# EAGLE design darwin-radio (EAGLE 9.6.1)
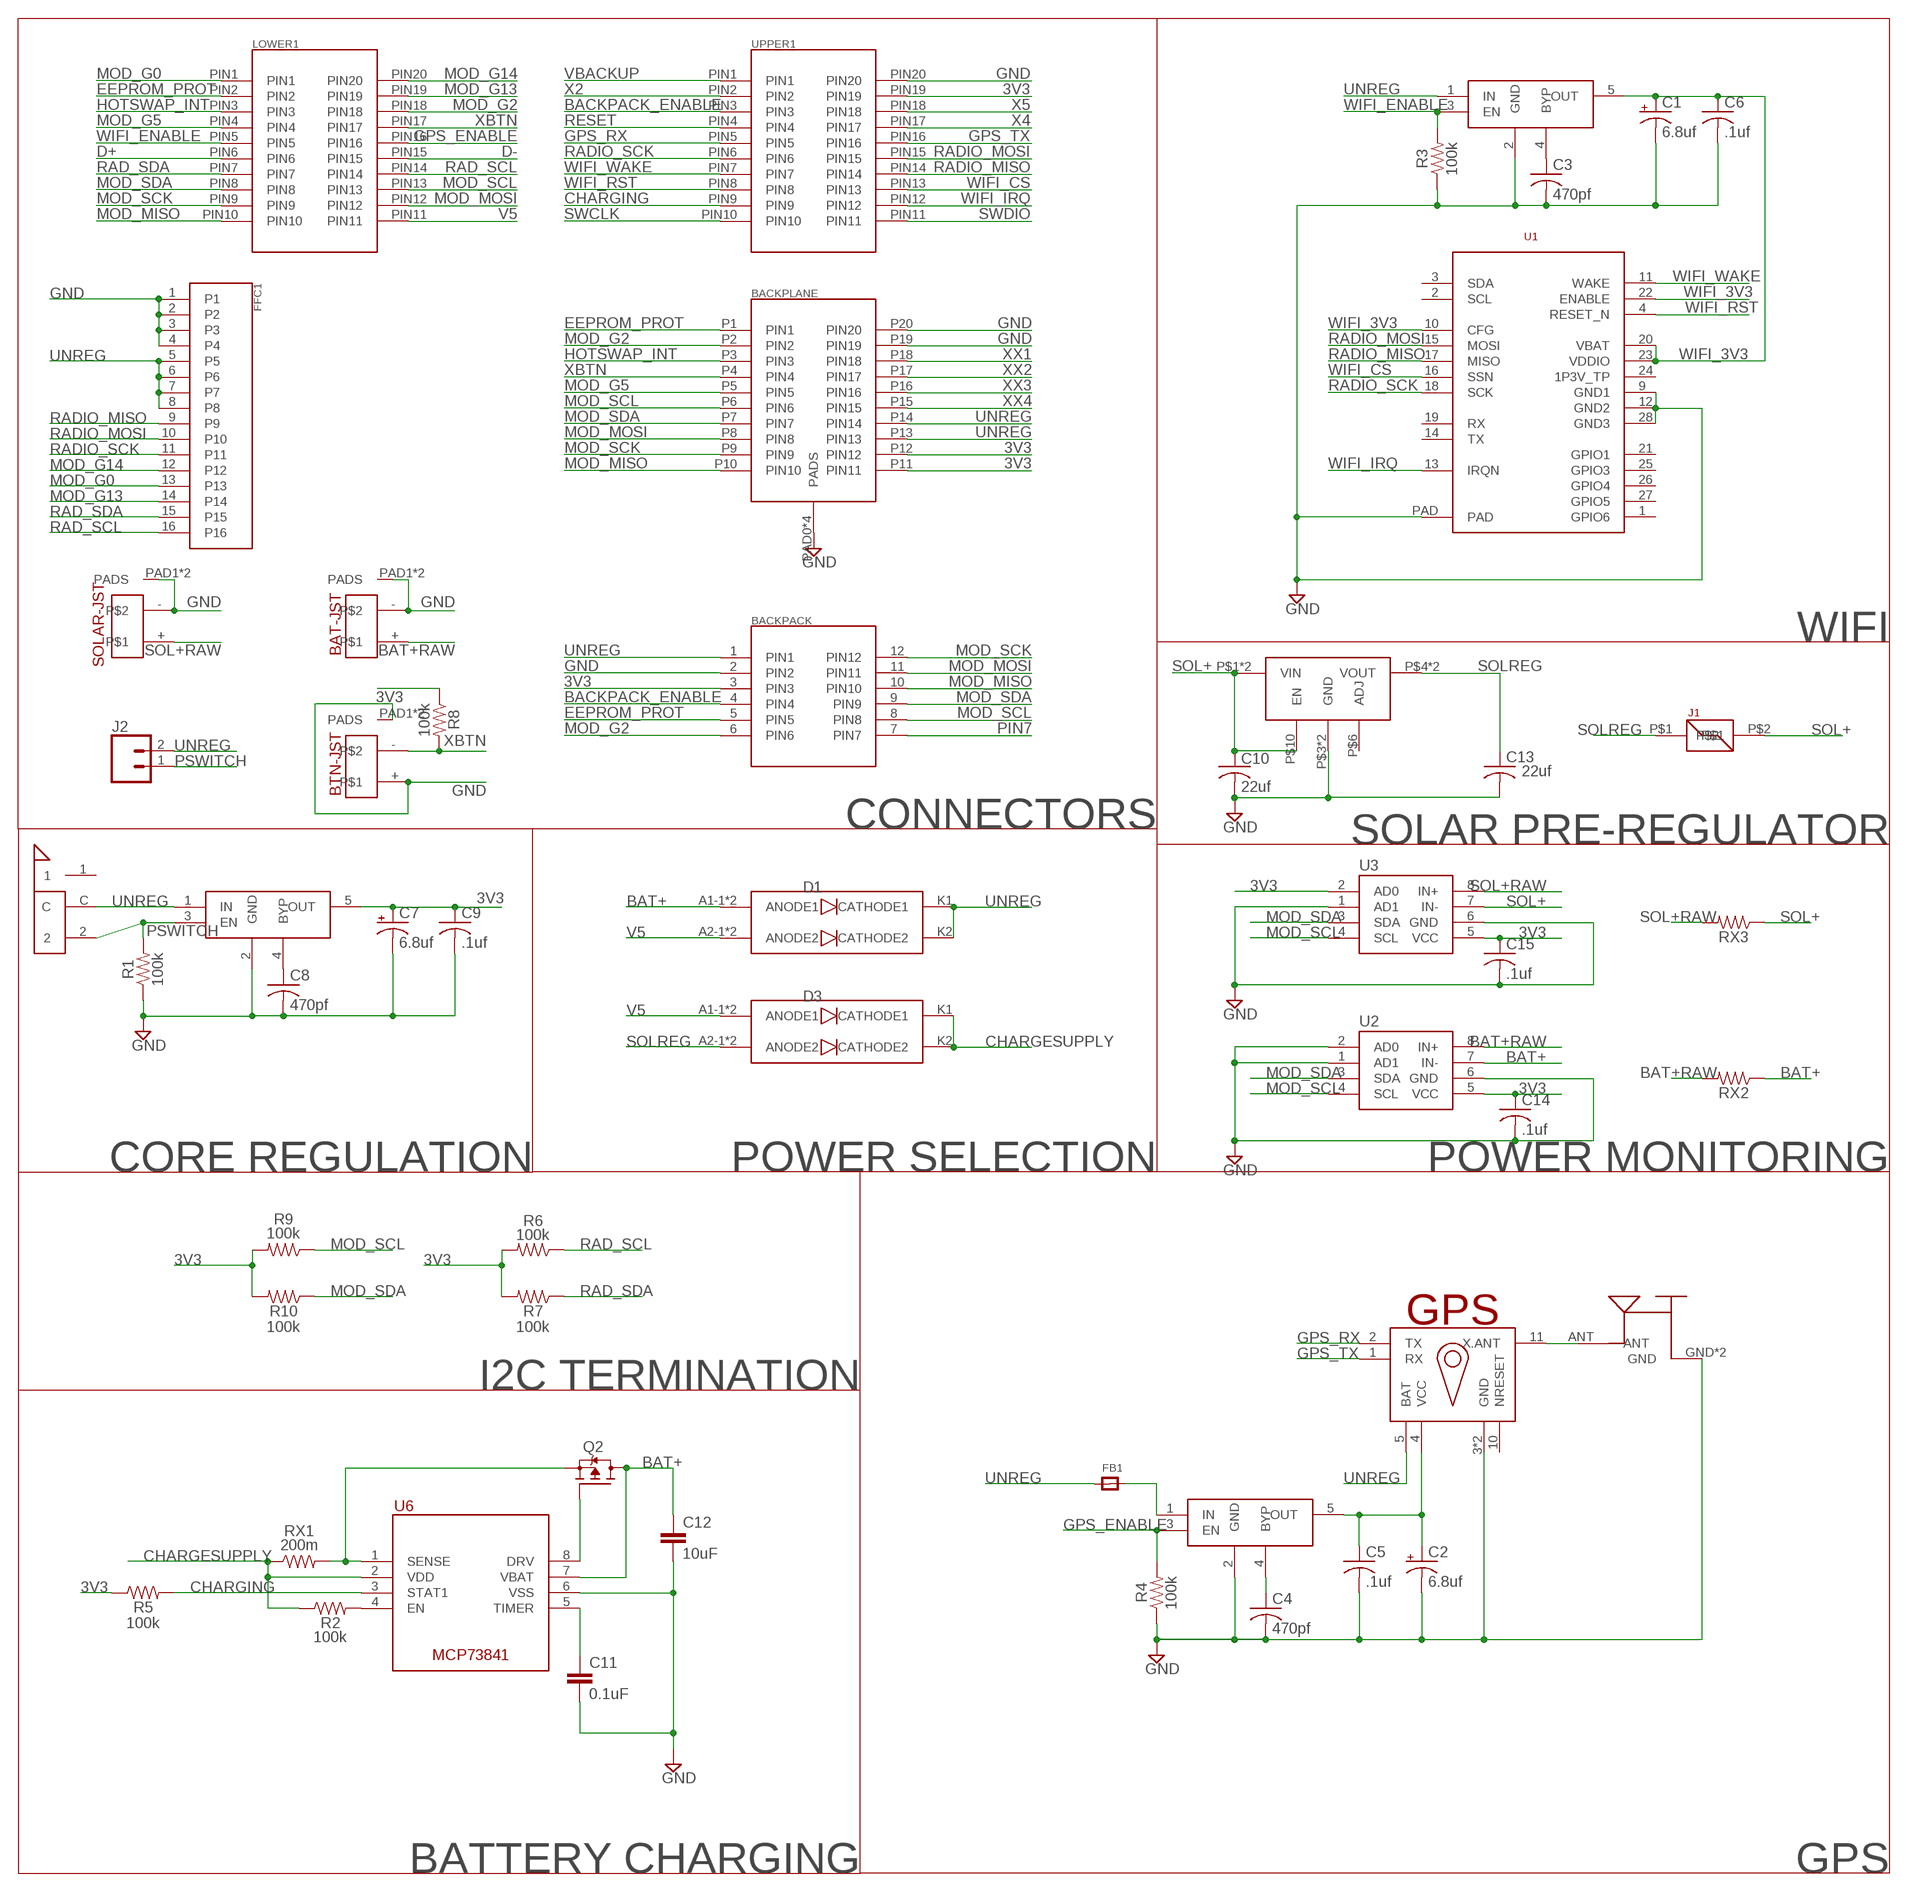
[diagram p0: schematic, sheet 1]

## Parts
BACKPACK  2X6-HEADERSDS  [12PH]
BACKPLANE  M55-6102042R  [M55-6102042R]
BAT-JST  B2B-PH-SM4-TB  [B2B-PH-SM4-TB]
BTN-JST  B2B-PH-SM4-TB  [B2B-PH-SM4-TB]
C1  6.8uf  CPOL-USA/3216-18R  [A/3216-18R]
C2  6.8uf  CPOL-USA/3216-18R  [A/3216-18R]
C3  470pf  C-USC0603K  [C0603K]
C4  470pf  C-USC0603K  [C0603K]
C5  .1uf  C-USC0603K  [C0603K]
C6  .1uf  C-USC0603K  [C0603K]
C7  6.8uf  CPOL-USA/3216-18R  [A/3216-18R]
C8  470pf  C-USC0603K  [C0603K]
C9  .1uf  C-USC0603K  [C0603K]
C10  22uf  C-USC0603K  [C0603K]
C11  0.1uF  0.1UF-0603-25V-(+80/-20%)  [0603]
C12  10uF  10UF-0603-6.3V-20%  [0603]
C13  22uf  C-USC0603K  [C0603K]
C14  .1uf  C-USC0603K  [C0603K]
C15  .1uf  C-USC0603K  [C0603K]
D1  V10KL45DUHM3/H  [V10KL45DUHM3/H]
D3  V10KL45DUHM3/H  [V10KL45DUHM3/H]
FB1  FERRITE0805  [0805]
FFC1  505110-1692  [505110-1692]
J1  S1911-46R  [S1911-46R]
J2  CONN_02LOCK_LONGPADS  [1X02_LOCK_LONGPADS]
LOWER1  MOLEX-15-91-2200  [20PH]
Q2  NDS8434  [SO08-IRF]
R1  100k  100KOHM-0603-1/10W-1%  [0603]
R2  100k  100KOHM-0603-1/10W-1%  [0603]
R3  100k  100KOHM-0603-1/10W-1%  [0603]
R4  100k  100KOHM-0603-1/10W-1%  [0603]
R5  100k  100KOHM-0603-1/10W-1%  [0603]
R6  100k  100KOHM-0603-1/10W-1%  [0603]
R7  100k  100KOHM-0603-1/10W-1%  [0603]
R8  100k  100KOHM-0603-1/10W-1%  [0603]
R9  100k  100KOHM-0603-1/10W-1%  [0603]
R10  100k  100KOHM-0603-1/10W-1%  [0603]
REG1  V78E06-1000-SMT-TR  [V78E06-1000-SMT-TR]
RX1  200m  R-US_R2512  [R2512]
RX2  100M  R-US_R2512  [R2512]
RX3  100M  R-US_R2512  [R2512]
SOLAR-JST  B2B-PH-SM4-TB  [B2B-PH-SM4-TB]
U1  ATWINC  [ATWINC]
U2  INA219  [SOIC127P599X175-8N]
U3  INA219  [SOIC127P599X175-8N]
U6  MCP7384X  [SOP65P490X110-8]
U$1  FGPMMOPA6HL80  [L80-M39]
U$2  MIC5219-3.3YM5-TR  [SOT95P280X145-5]
U$3  MIC5219-3.3YM5-TR  [SOT95P280X145-5]
U$4  MIC5219-3.3YM5-TR  [SOT95P280X145-5]
U$5  SSAJ110100  [SSAJ110100]
U$11  2337019-1  [2337019-1]
UPPER1  MOLEX-15-91-2200  [20PH]

## Nets
3V3: BACKPACK.3(PIN3) BACKPLANE.P11(PIN11) BACKPLANE.P12(PIN12) C7.+ C9.1 C14.1 C15.1 R5.1 R6.2 R7.2 R8.1 R9.2 R10.2 U2.5(VCC) U3.2(AD0) U3.5(VCC) U$4.5(OUT) UPPER1.PIN19
BACKPACK_ENABLE: BACKPACK.4(PIN4) UPPER1.PIN3
BAT+: C12.1 D1.A1-1(ANODE1) D1.A1-2(ANODE1) Q2.5(D) Q2.6(D) Q2.7(D) Q2.8(D) RX2.1 U2.7(IN-) U6.7(VBAT)
BAT+RAW: BAT-JST.+ RX2.2 U2.8(IN+)
CHARGESUPPLY: D3.K1(CATHODE1) D3.K2(CATHODE2) R2.1 RX1.1 U6.2(VDD)
CHARGING: R5.2 U6.3(STAT1) UPPER1.PIN9
D+: LOWER1.PIN6
D-: LOWER1.PIN15
EEPROM_PROT: BACKPACK.5(PIN5) BACKPLANE.P1(PIN1) LOWER1.PIN2
GND: BACKPACK.2(PIN2) BACKPLANE.P19(PIN19) BACKPLANE.P20(PIN20) BACKPLANE.PAD0(PADS) BACKPLANE.PAD1(PADS) BACKPLANE.PAD2(PADS) BACKPLANE.PAD3(PADS) BAT-JST.- BAT-JST.PAD1(PADS) BAT-JST.PAD2(PADS) BTN-JST.+ BTN-JST.PAD1(PADS) BTN-JST.PAD2(PADS) C1.- C2.- C3.2 C4.2 C5.2 C6.2 C7.- C8.2 C9.2 C10.2 C11.2 C12.2 C13.2 C14.2 C15.2 FFC1.1 FFC1.2 FFC1.3 FFC1.4 R1.1 R3.1 R4.1 REG1.P$3(GND) REG1.P$7(GND) SOLAR-JST.- SOLAR-JST.PAD1(PADS) SOLAR-JST.PAD2(PADS) U1.9(GND1) U1.12(GND2) U1.28(GND3) U1.PAD U2.1(AD1) U2.2(AD0) U2.6(GND) U3.1(AD1) U3.6(GND) U6.6(VSS) U$1.3(GND) U$1.12(GND) U$2.2(GND) U$3.2(GND) U$4.2(GND) U$11.GND U$11.GND2(GND) UPPER1.PIN20
GPS_ENABLE: LOWER1.PIN16 R4.2 U$2.3(EN)
GPS_RX: U$1.2(TX) UPPER1.PIN5
GPS_TX: U$1.1(RX) UPPER1.PIN16
HOTSWAP_INT: BACKPLANE.P3(PIN3) LOWER1.PIN3
MOD_G0: FFC1.13 LOWER1.PIN1
MOD_G2: BACKPACK.6(PIN6) BACKPLANE.P2(PIN2) LOWER1.PIN18
MOD_G5: BACKPLANE.P5(PIN5) LOWER1.PIN4
MOD_G13: FFC1.14 LOWER1.PIN19
MOD_G14: FFC1.12 LOWER1.PIN20
MOD_MISO: BACKPACK.10(PIN10) BACKPLANE.P10(PIN10) LOWER1.PIN10
MOD_MOSI: BACKPACK.11(PIN11) BACKPLANE.P8(PIN8) LOWER1.PIN12
MOD_SCK: BACKPACK.12(PIN12) BACKPLANE.P9(PIN9) LOWER1.PIN9
MOD_SCL: BACKPACK.8(PIN8) BACKPLANE.P6(PIN6) LOWER1.PIN13 R9.1 U2.4(SCL) U3.4(SCL)
MOD_SDA: BACKPACK.9(PIN9) BACKPLANE.P7(PIN7) LOWER1.PIN8 R10.1 U2.3(SDA) U3.3(SDA)
N$1: C3.1 U$3.4(BYP)
N$2: C4.1 U$2.4(BYP)
N$3: C2.+ C5.1 U$1.4(VCC) U$2.5(OUT)
N$4: U$1.11(X.ANT) U$11.ANT
N$5: R2.2 U6.4(EN)
N$6: C8.1 U$4.4(BYP)
N$7: FB1.2 U$2.1(IN)
N$14: Q2.1(S) Q2.2(S) Q2.3(S) RX1.2 U6.1(SENSE)
N$17: Q2.4(G) U6.8(DRV)
N$18: C11.1 U6.5(TIMER)
PIN7: BACKPACK.7(PIN7)
PSWITCH: J2.1 R1.2 U$4.3(EN) U$5.2
RAD_SCL: FFC1.16 LOWER1.PIN14 R6.1
RAD_SDA: FFC1.15 LOWER1.PIN7 R7.1
RADIO_MISO: FFC1.9 U1.17(MISO) UPPER1.PIN14
RADIO_MOSI: FFC1.10 U1.15(MOSI) UPPER1.PIN15
RADIO_SCK: FFC1.11 U1.18(SCK) UPPER1.PIN6
RESET: UPPER1.PIN4
SOL+: C10.1 J1.P$2 REG1.P$1(VIN) REG1.P$2(VIN) REG1.P$10(EN) RX3.1 U3.7(IN-)
SOL+RAW: RX3.2 SOLAR-JST.+ U3.8(IN+)
SOLREG: C13.1 D3.A2-1(ANODE2) D3.A2-2(ANODE2) J1.P$1 REG1.P$4(VOUT) REG1.P$5(VOUT)
SWCLK: UPPER1.PIN10
SWDIO: UPPER1.PIN11
UNREG: BACKPACK.1(PIN1) BACKPLANE.P13(PIN13) BACKPLANE.P14(PIN14) D1.K1(CATHODE1) D1.K2(CATHODE2) FB1.1 FFC1.5 FFC1.6 FFC1.7 FFC1.8 J2.2 U$1.5(BAT) U$3.1(IN) U$4.1(IN) U$5.C
V5: D1.A2-1(ANODE2) D1.A2-2(ANODE2) D3.A1-1(ANODE1) D3.A1-2(ANODE1) LOWER1.PIN11
VBACKUP: UPPER1.PIN1
WIFI_3V3: C1.+ C6.1 U1.10(CFG) U1.20(VBAT) U1.22(ENABLE) U1.23(VDDIO) U$3.5(OUT)
WIFI_CS: U1.16(SSN) UPPER1.PIN13
WIFI_ENABLE: LOWER1.PIN5 R3.2 U$3.3(EN)
WIFI_IRQ: U1.13(IRQN) UPPER1.PIN12
WIFI_RST: U1.4(RESET_N) UPPER1.PIN8
WIFI_WAKE: U1.11(WAKE) UPPER1.PIN7
X2: UPPER1.PIN2
X4: UPPER1.PIN17
X5: UPPER1.PIN18
XBTN: BACKPLANE.P4(PIN4) BTN-JST.- LOWER1.PIN17 R8.2
XX1: BACKPLANE.P18(PIN18)
XX2: BACKPLANE.P17(PIN17)
XX3: BACKPLANE.P16(PIN16)
XX4: BACKPLANE.P15(PIN15)
Unconnected: REG1.P$6(ADJ) U1.1(GPIO6) U1.2(SCL) U1.3(SDA) U1.14(TX) U1.19(RX) U1.21(GPIO1) U1.24(1P3V_TP) U1.25(GPIO3) U1.26(GPIO4) U1.27(GPIO5) U$1.10(NRESET) U$5.1

## Notes on the sheet
- WIFI
- CONNECTORS
- SOLAR PRE-REGULATOR
- CORE REGULATION | POWER SELECTION | POWER MONITORING
- I2C TERMINATION
- BATTERY CHARGING | GPS

## Library data of the parts
BACKPACK = Conservify:2X6-HEADERS
BACKPLANE = Conservify:M55-6102042R
BAT-JST BTN-JST SOLAR-JST = Conservify:B2B-PH-SM4-TB
C1 C2 C7 = rcl:CPOL-US: POLARIZED CAPACITOR, American symbol; SPICEPREFIX: C
C3-C6 C8-C10 C13-C15 = rcl:C-US: CAPACITOR, American symbol; SPICEPREFIX: C
C11 = SparkFun-Capacitors:0.1UF: 0.1µF ceramic capacitors A capacitor is a passive two-terminal electrical component used to store electrical energy temporarily in an electric field.; PROD_ID: CAP-00810
C12 = SparkFun-Capacitors:10UF: 10.0µF ceramic capacitors A capacitor is a passive two-terminal electrical component used to store electrical energy temporarily in an electric field.; PROD_ID: CAP-11015
D1 D3 = Conservify:V10KL45DUHM3/H
FB1 = microbuilder:FERRITE: Ferrite Bead 0603 MMZ1608B121C - 120 Ohm @ 100MHz, 600mA, 0.15 Ohm DC Resistance - Digikey: 445-2164-1-ND BK1608HW121-T - 120 Ohm, 600mA Ferrite Chip - Digikey: 587-1876-2-ND 0805 HZ0805B272R-10 - 2.7K Ohm @ 100MHz, 200mA, 0.8 Ohm DC Resistance - Digikey: 240-2504-1-ND (see also Murata BLM21BD272SN1L) MMZ2012Y152B - 1.5K Ohm @ 100MHz, 500mA, 0.4 Ohm DC Resistance - Digikey: 445-1560-1-ND - Mainly for high frequency (80-400MHz) MMZ2012R102A - 1K Ohm @ 100MHz, 500mA, 0.3 Ohm DC Resistance - Digikey: 445-1555-2-ND - More general purpose (10-200MHz)
FFC1 = Conservify:505110-1692
J1 = Conservify:S1911-46R
J2 = SparkFun-Connectors:CONN_02: Multi connection point. Often used as Generic Header-pin footprint for 0.1 inch spaced/style header connections On any of the 0.1 inch spaced packages, you can populate with these: Break Away Headers - Straight <https://www.sparkfun.com/products/116> (PRT-00116) Break Away Male Headers - Right Angle <https://www.sparkfun.com/products/553> (PRT-00553) Female Headers <https://www.sparkfun.com/products/115> (PRT-00115) Break Away Headers - Machine Pin <https://www.sparkfun.com/products/117> (PRT-00117) Break Away Female Headers - Swiss Machine Pin <https://www.sparkfun.com/products/743> (PRT-00743) For SCREWTERMINALS and SPRING TERMINALS visit here: Screw Terimnals on SparkFun.com <https://www.sparkfun.com/search/results?term=Screw+Terminals> (5mm/3.5mm/2.54mm spacing) This device is also useful as a general connection point to wire up your design to another part of your project. Our various solder wires solder well into these plated through hole pads. Hook-Up Wire - Assortment (Stranded, 22 AWG) <https://www.sparkfun.com/products/11375> (PRT-11375) Hook-Up Wire - Assortment (Solid Core, 22 AWG) <https://www.sparkfun.com/products/11367> (PRT-11367) View the entire wire category on our website here <https://www.sparkfun.com/categories/141> Special notes: Molex polarized connector foot print use with: PRT-08233 with associated crimp pins and housings. 2.54_SCREWTERM for use with PRT-10571. 3.5mm Screw Terminal footprints for PRT-08084 5mm Screw Terminal footprints for use with PRT-08432
LOWER1 UPPER1 = Conservify:MOLEX-15-91-2200
Q2 = Conservify:NDS8434: NDS8434 Single P-Channel Enhancement Mode Field Effect Transistor
R1-R10 = SparkFun-Resistors:100KOHM: 100kΩ resistor A resistor is a passive two-terminal electrical component that implements electrical resistance as a circuit element. Resistors act to reduce current flow, and, at the same time, act to lower voltage levels within circuits. - Wikipedia; PROD_ID: RES-07828
REG1 = Conservify:V78E06-1000-SMT-TR: NON-ISOLATED DC SWITCHING REGULATOR
RX1-RX3 = rcl:R-US_: RESISTOR, American symbol; SPICEPREFIX: R
U1 = Conservify:ATWINC
U2 U3 = Conservify:INA219
U6 = Conservify:MCP7384X: Advanced Single or Dual Cell Lithium-Ion/ Lithium-Polymer Charge Management Controllers
U$1 = Conservify:FGPMMOPA6H
U$2-U$4 = Conservify:MIC5219-3.3YM5-TR
U$5 = Conservify:SSAJ110100
U$11 = Conservify:2337019-1

## Board
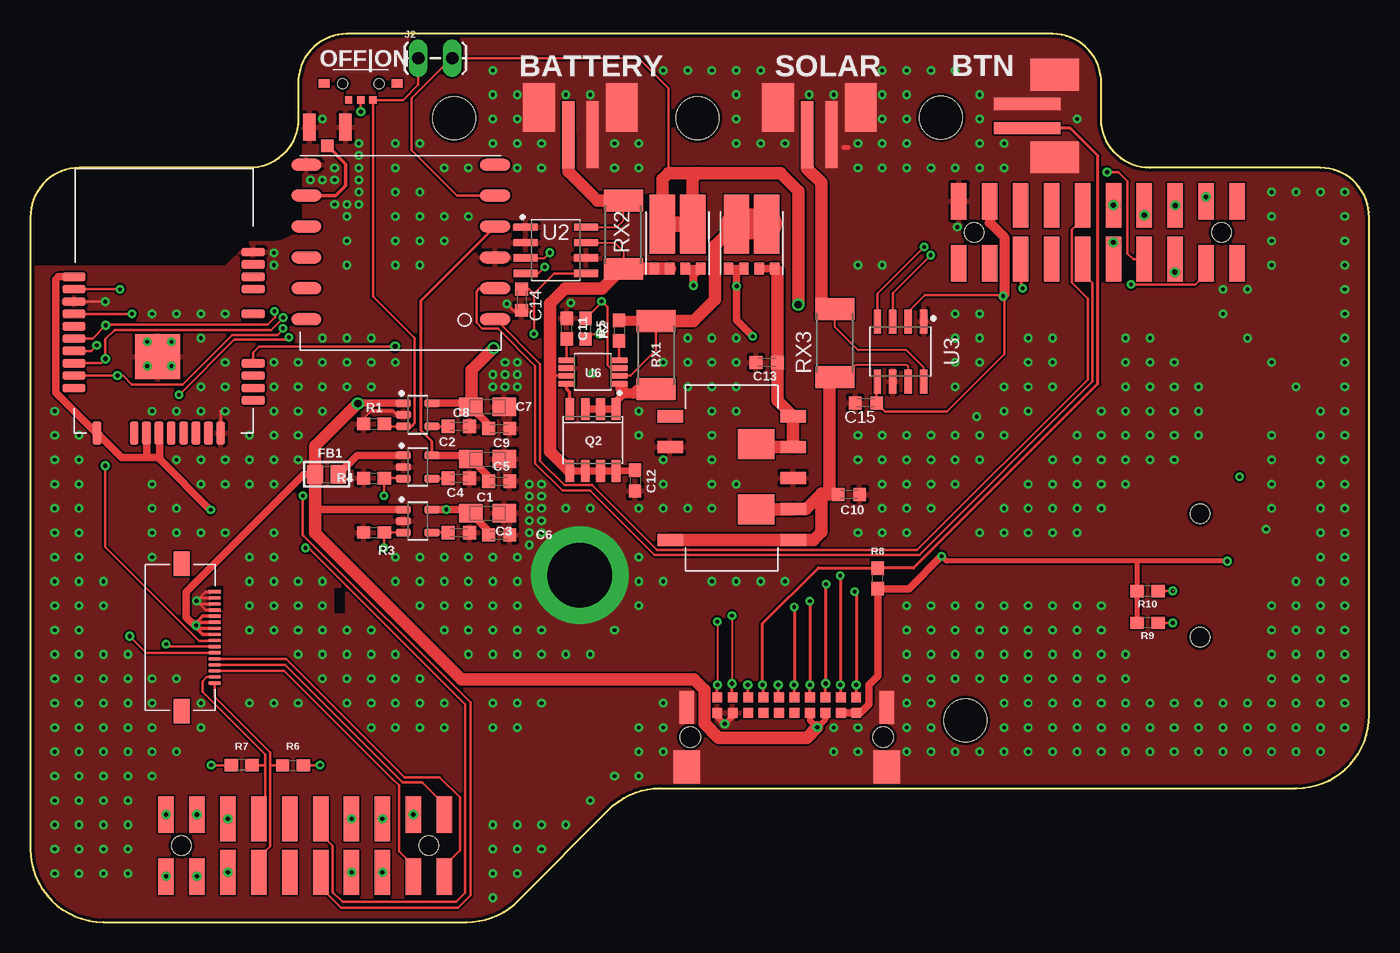
[diagram p1: board, top side]
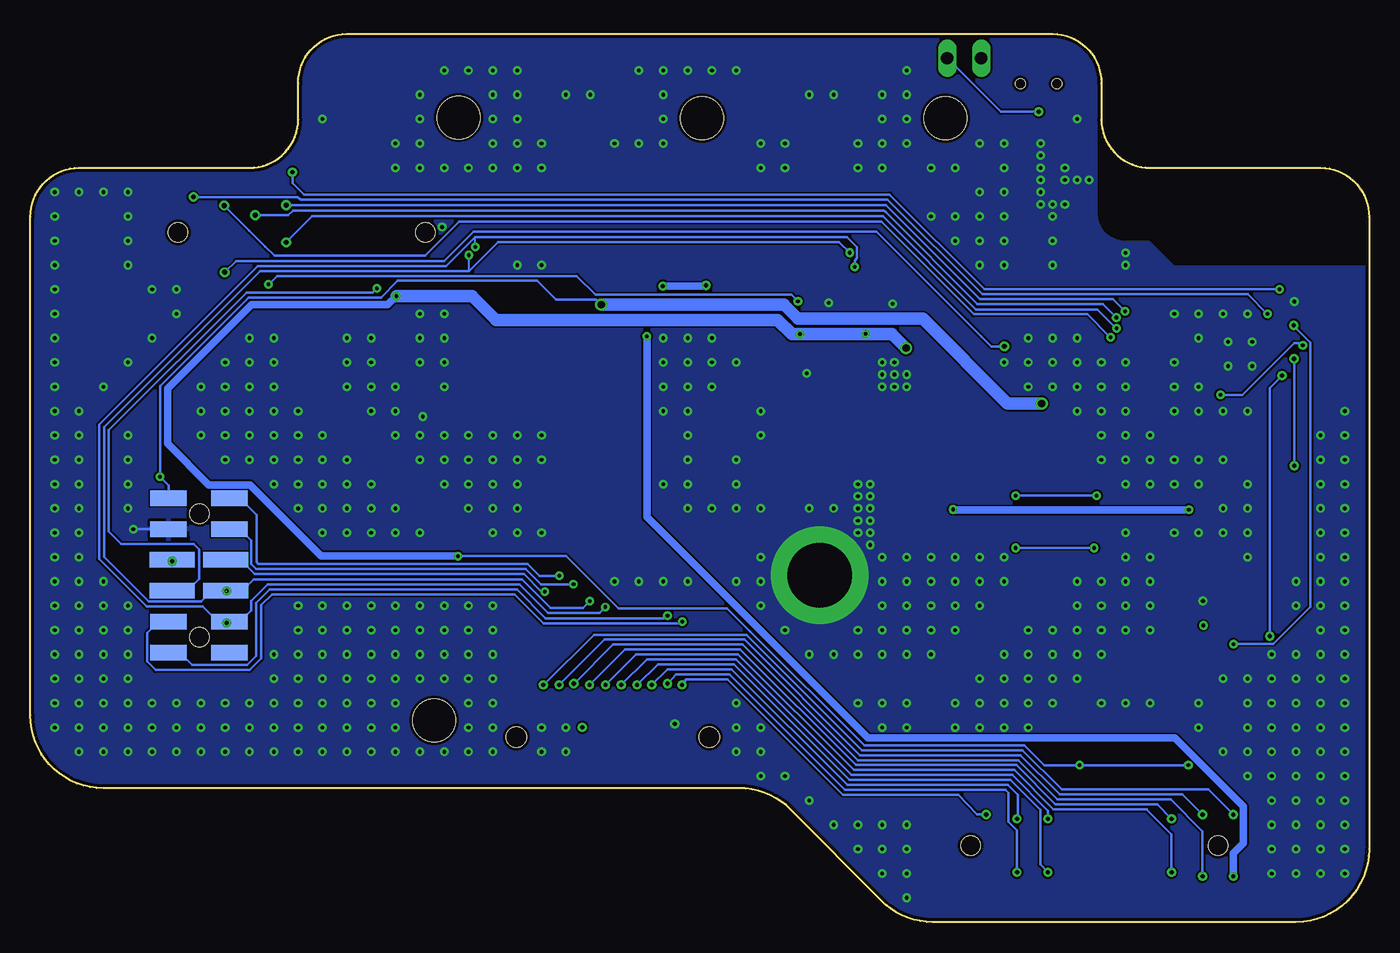
[diagram p2: board, bottom side, seen from below]

Size 110 x 73 mm. Coordinates in mm from the lower left corner, seen from the top.
Outline: 110,57.94 arc90 106,62 92,62 arc-90 88,65.94 88,68.94 arc90 84,73 26,73 arc90 22,68.94 22,65.94 arc-90 18,62 4,62 arc90 0,57.94 0,6 arc90 6,0 35.85,0 arc45 40.11,1.78 47.49,9.22 arc-45 51.75,11 104,11 arc90 110,17 110,57.94
Copper layers (1*16): Top 0.035mm / dielectric 1.5mm / Bottom 0.035mm
Design rules "default *": minimum track width 6mil, minimum drill 0.3mm, track to track 6mil, track to pad 6mil, pad to pad 6mil, via to via 6mil, smd to smd 6mil, copper to edge 10mil, drill to drill 6mil, minimum pad ring 10mil, minimum via ring 8mil, stop-mask expansion 4mil, vias tented up to drill 1mm, thermal gap 10mil
Holes 3.5 mm at 34.82,66.08 54.82,66.08 74.82,66.13 76.82,16.58

### Footprints (pad centres in the part's own frame; a part is rotated, then mirrored left to right if it is on the bottom)
12PH = smd 3 x 1.27: 1 -2.5,6.35; 2 -2.5,3.81; 5 -2.5,-3.81; 6 -2.5,-6.35; 7 2.5,-6.35; 8 2.5,-3.81; 11 2.5,3.81; 12 2.5,6.35 | smd 3.68 x 1.27: 3 -2.2,1.27; 4 -2.2,-1.27; 9 2.2,-1.27; 10 2.2,1.27 | hole 1.58: 0.041,5.08; 0.041,-5.08
M55-6102042R = smd 0.8 x 0.8: P1 -5.715,3.27; P2 -4.445,3.27; P3 -3.175,3.27; P4 -1.905,3.27; P5 -0.635,3.27; P6 0.635,3.27; P7 1.905,3.27; P8 3.175,3.27; P9 4.445,3.27; P10 5.715,3.27; P11 5.715,2; P12 4.445,2; P13 3.175,2; P14 1.905,2; P15 0.635,2; P16 -0.635,2; P17 -1.905,2; P18 -3.175,2; P19 -4.445,2; P20 -5.715,2 | smd 2.2 x 2.7: PAD0 -8.21,-2.45; PAD1 8.21,-2.45 | smd 1.2 x 2.7: PAD2 8.21,2.45; PAD3 -8.21,2.45 | hole 1.65: -7.925,0; 7.925,0
B2B-PH-SM4-TB = smd 1 x 5.5: + -1,-1; - 1,-1 | smd 2.6 x 4: PAD1 3.4,1.25; PAD2 -3.4,1.25
A/3216-18R = smd 1.95 x 1.5: + 1.375,0; - -1.375,0
C0603K = smd 1.05 x 1.08: 1 -0.875,0; 2 0.875,0
0603 = smd 1.1 x 1: 1 -0.85,0; 2 0.85,0
V10KL45DUHM3/H = smd 0.762 x 0.991: A1-1 -1.905,0.495; A1-2 -0.635,0.495; A2-1 0.635,0.495; A2-2 1.905,0.495 | smd 2.083 x 4.851: K1 -1.245,4.153; K2 1.245,4.153
0805 = smd 1.3 x 1.5: 1 -0.95,0; 2 0.95,0
505110-1692 = smd 0.3 x 1: 1 -3.75,2.7; 2 -3.25,2.7; 3 -2.75,2.7; 4 -2.25,2.7; 5 -1.75,2.7; 6 -1.25,2.7; 7 -0.75,2.7; 8 -0.25,2.7; 9 0.25,2.7; 10 0.75,2.7; 11 1.25,2.7; 12 1.75,2.7; 13 2.25,2.7; 14 2.75,2.7; 15 3.25,2.7; 16 3.75,2.7 | smd 2 x 1.3: PAD1 -6.05,0; PAD2 6.05,0
S1911-46R = smd 2.48 x 3: P$1 -2.69,0; P$2 2.69,0
1X02_LOCK_LONGPADS = drill 1.016 long: 1 -0.127,0; 2 2.667,0
20PH = smd 3 x 1.27: PIN1 -0.34,0; PIN2 -0.34,-2.54; PIN9 -0.34,-20.32; PIN10 -0.34,-22.86; PIN11 4.74,-22.86; PIN12 4.74,-20.32; PIN19 4.74,-2.54; PIN20 4.74,0 | smd 3.68 x 1.27: PIN3 0,-5.08; PIN4 0,-7.62; PIN5 0,-10.16; PIN6 0,-12.7; PIN7 0,-15.24; PIN8 0,-17.78; PIN13 4.4,-17.78; PIN14 4.4,-15.24; PIN15 4.4,-12.7; PIN16 4.4,-10.16; PIN17 4.4,-7.62; PIN18 4.4,-5.08 | hole 1.58: 2.2,-1.27; 2.2,-21.59
SO08-IRF = smd 0.72 x 1.78: 1 -1.905,-2.543; 2 -0.635,-2.543; 3 0.635,-2.543; 4 1.905,-2.543; 5 1.905,2.543; 6 0.635,2.543; 7 -0.635,2.543; 8 -1.905,2.543
V78E06-1000-SMT-TR = smd 1 x 2.1: P$1 -5.08,-5.05; P$2 -2.54,-5.05; P$3 0,-5.05; P$4 2.54,-5.05; P$5 5.08,-5.05; P$6 5.08,5.05; P$7 2.54,5.05; P$10 -5.08,5.05
R2512 = smd 1.8 x 3.2: 1 -2.8,0; 2 2.8,0
ATWINC = smd 1.9 x 0.7: 1 7.365,2.67; 2 7.365,3.686; 3 7.365,4.702; 4 7.365,5.718; 5 7.365,9.782; 6 7.365,11.814; 7 7.365,12.83; 8 7.365,13.846; 9 7.365,14.862; 10 -7.365,12.83; 11 -7.365,11.814; 12 -7.365,10.798; 13 -7.365,9.782; 14 -7.365,8.766; 15 -7.365,7.75; 16 -7.365,6.734; 17 -7.365,5.718; 18 -7.365,4.702; 19 -7.365,3.686 | smd 0.7 x 1.9: 20 -5.465,0; 21 -2.417,0; 22 -1.401,0; 23 -0.385,0; 24 0.631,0; 25 1.647,0; 26 2.663,0; 27 3.679,0; 28 4.695,0 | smd 3.7 x 3.7: PAD -0.485,6.27
SOIC127P599X175-8N = smd 1.965 x 0.602: 1 -2.47,1.905; 2 -2.47,0.635; 3 -2.47,-0.635; 4 -2.47,-1.905; 5 2.47,-1.905; 6 2.47,-0.635; 7 2.47,0.635; 8 2.47,1.905
SOP65P490X110-8 = smd 1.412 x 0.492: 1 -2.15,0.975; 2 -2.15,0.325; 3 -2.15,-0.325; 4 -2.15,-0.975; 5 2.15,-0.975; 6 2.15,-0.325; 7 2.15,0.325; 8 2.15,0.975
L80-M39 = smd 2.5 x 1: 1 8,-6.45; 2 8,-3.91; 3 8,-1.37; 4 8,1.17; 5 8,3.71; 6 8,6.25; 7 -7.5,-6.45; 8 -7.5,-3.91; 9 -7.5,-1.37; 10 -7.5,1.17; 11 -7.5,3.71; 12 -7.5,6.25
SOT95P280X145-5 = smd 1.262 x 0.609: 1 -1.175,0.95; 2 -1.175,0; 3 -1.175,-0.95; 4 1.175,-0.95; 5 1.175,0.95
SSAJ110100 = smd 0.6 x 0.6: 1 1,1.355; 2 -1,1.355; C 0,1.355 | smd 0.9 x 0.7: PAD -3,0; PAD2 3,0 | hole 0.8: -1.5,0; 1.5,0
2337019-1 = smd 1.05 x 1: ANT 0,-1.525 | smd 1.05 x 2.2: GND -1.475,0; GND2 1.475,0

### Placement (x,y rotation side)
BACKPACK  96.15,28.5 0 bottom
BACKPLANE  62.15,15.2 0 top
BAT-JST  45.2,65.7 0 top
BTN-JST  82.9,66.25 270 top
C1  37.56,33.61 180 top
C2  37.56,38.05 180 top
C3  35.2,32.01 0 top
C4  35.2,36.48 0 top
C5  38.51,36.24 0 top
C6  38.51,31.81 0 top
C7  37.56,42.35 180 top
C8  35.2,40.75 0 top
C9  38.51,40.56 0 top
C10  67.26,35.15 0 top
C11  44.07,48.77 90 top
C12  49.68,36.28 270 top
C13  60.5,46 180 top
C14  40.36,51.16 270 top
C15  68.66,42.67 180 top
D1  53.18,53.23 0 top
D3  59.26,53.23 0 top
FB1  24.35,36.8 0 top
FFC1  12.43,23.4 270 top
J1  59.63,36.6 270 top
J2  32,71 0 top
LOWER1  34.01,8.5 270 top
Q2  46.22,39.62 180 top
R1  28.23,40.95 0 top
R2  48.37,48.62 270 top
R3  28.23,32.02 0 top
R4  28.23,36.48 0 top
R5  45.63,48.77 90 top
R6  21.57,12.87 0 top
R7  17.36,12.9 180 top
R8  69.62,28.24 90 top
R9  91.8,24.6 180 top
R10  91.8,27.2 180 top
REG1  57.63,36.5 90 top
RX1  51.41,46.61 270 top
RX2  48.72,56.49 90 top
RX3  66.1,47.6 90 top
SOLAR-JST  64.83,65.7 0 top
U1  10.94,40.21 0 top
U2  43.17,55.22 0 top
U3  71.5,46.9 270 top
U6  46.22,45.21 180 top
U$1  30.18,56 0 top
U$2  31.82,37.41 0 top
U$3  31.82,32.96 0 top
U$4  31.82,41.7 0 top
U$5  27.14,68.92 180 top
U$11  24.41,65.32 0 top
UPPER1  76.29,54.5 90 top

### Tracks (layer width: path | path; a pad name or v marks a point on that pad's centre or on a via)
3V3  (via drill 0.3, 0.35, 0.6)
  Top 0.152: R5.1 46.03,48.33 v46.76,48.33
  Top 0.2: R7.2 v14.85,12.9 | R6.2 22.45,12.9 v23.8,12.9
  Top 0.203: U2.5 43.05,53.31 41.38,51.65 | 41.38,51.65 v41.38,48.34 | C14.1 40.99,52.03 41.38,51.65 | U3.2 72.14,50.16 73.51,51.54 80.02,51.54 80.02,46.7 75.3,41.97 70.23,41.97 C15.1 69.53,44.37 U3.5
  Top 0.406: v98.35,29.67 91.03,29.67 | 91.03,29.67 75.28,29.67 v74.88,30.07 | R9.2 R10.2 90.95,29.58 91.03,29.67
  Top 0.61: v74.88,30.07 72.2,27.39 R8.1 69.62,20.25 68.89,19.51 68.89,17.88 68.2,17.2 BACKPLANE.P11 BACKPLANE.P12 | U$4.5 35.88,42.65 C7.+ 37.64,40.9 C9.1
  Top 0.813: 79.03,59.44 UPPER1.PIN19 78.83,57.48 80.02,56.29 80.02,51.54 v79.93,51.45
  Top 1.016: C7.+ 36.25,42.41 36.25,45.38 v38.05,47.17
  Bottom 0.152: v41.38,48.34 41.92,48.34 41.94,48.33 | BACKPACK.3 v98.35,29.67
  Bottom 0.2: v14.85,12.9 v23.8,12.9 26.68,12.9 28.31,14.53 41.48,14.53 50.89,23.91 52.77,25.79 61.69,25.79 65.97,30.07 v74.88,30.07
  Bottom 0.61: v74.88,30.07 86.09,30.07 91.96,35.94 95.34,35.94 98.73,39.33 98.73,43.83 91.83,50.74 80.64,50.74 v79.93,51.45
  Bottom 1.016: v38.05,47.17 39.2,48.33 41.94,48.33 v46.76,48.33 47.42,48.33 48.6,49.5 71.75,49.5 73.7,51.45 v79.93,51.45
BACKPACK_ENABLE  (via drill 0.3)
  Top 0.254: UPPER1.PIN3 81.37,52.26 v81.53,52.09
  Bottom 0.203: v81.53,52.09 81.88,51.75 92.25,51.75 103.55,40.45 103.55,32.1 102.53,31.08 96.59,31.08 96.13,30.62 96.13,28.22 97,27.35 98.23,27.35 BACKPACK.4
BAT+
  Top 0.152: U2.7 47.98,55.85 48.72,55.12 RX2.1 | U6.7 44.05,44.91
  Top 0.203: 44.05,44.91 42.7,44.91
  Top 0.61: C12.1 Q2.8 Q2.7 Q2.6 Q2.5
  Top 1.016: Q2.5 42.7,38.69 42.7,44.91 42.7,50.83 43.94,52.07 46.99,52.07 48.61,53.69 RX2.1 51.24,53.69 D1.A1-1 D1.A1-2
BAT+RAW
  Top 0.152: U2.8 48.18,57.12 48.72,57.66 RX2.2
  Top 1.016: BAT-JST.+ 44.2,61.7 46.6,59.29 RX2.2
CHARGESUPPLY
  Top 0.203: U6.2 48.42,44.93 49.33,44.93 51.41,47.01 RX1.1
  Top 0.813: RX1.1 48.44,49.41 R2.1
  Top 1.016: D3.K1 56.25,55.61 56.25,51.17 54.49,49.41 RX1.1
  Top 2.54: D3.K2 D3.K1
CHARGING  (via drill 0.3)
  Top 0.203: U6.3 47.67,45.53 47.41,45.8 47.41,50.55 v46.93,51.03 46.93,50.92 R5.2 | UPPER1.PIN9 96.61,53.28 95.73,52.4 v90.44,52.4
  Bottom 0.203: v46.93,51.03 47.46,51.57 63.57,51.57 65.12,53.11 89.73,53.11 v90.44,52.4
EEPROM_PROT  (via drill 0.3, 0.35)
  Top 0.152: v56.45,24.68 v56.45,19.5
  Top 0.254: BACKPLANE.P1 56.44,19.48 v56.45,19.5
  Bottom 0.203: LOWER1.PIN2 32.21,8.84 33.73,10.47 43.23,10.47 52.72,19.96 56.15,19.96 v56.45,19.5 | v56.45,24.68 56.58,24.55 67.83,24.55 70.23,26.95 90.14,26.95 91.03,26.06 91.03,21.69 92,20.73 99.72,20.73 100.4,21.41 100.4,22.89 100.4,23.75 99.47,24.69 BACKPACK.5
  other vias: 31.47,8.84
GND  (via drill 0.3, 0.35, 5.3 pad 8)
  Top 0.152: R1.1 27.38,41.38 28,42
  Top 0.203: U1.28 15.64,41.99 15.65,42 | C6.2 39.41,31.83 | U1.12 v6.14,51.01 v6.15,51 | FFC1.1 14.39,27.14 v13.65,26.4 | FFC1.2 13.89,26.64 v13.65,26.4 | FFC1.3 13.9,26.14 v13.65,26.4 | FFC1.4 14.4,25.64 v13.65,26.4
  Top 0.254: v39.14,50.82 39.68,50.28 C14.2
  Top 0.305: U$4.2 30.1,41.7 29.8,42 28,42
  Top 0.406: U6.6 44.02,45.49 | 65.83,67.22 65.75,67.3 | 66.84,63.68 67.18,63.68
  Top 0.508: BACKPLANE.P20 56.44,16.91 v57.05,16.3 57.1,16.3 57.7,16.91 BACKPLANE.P19
  Bottom 0.203: BACKPACK.2 v101.54,32.31 v101.55,32.3
  other vias: 11.6,47.7 11.6,45.7 9.6,45.7 9.6,47.7 76.17,57.12 77.75,41.55 45.15,28.5 68,40 58,36 56,36 56,34 50,40 54,34 52,34 50,34 52,36 52,38 50,42 56,42 56,40 56,38 58,42 58,44 56,44 54,44 52,46 54,46 56,46 58,46 58,48 56,48 54,48 76,46 76,48 76,50 78,50 78,48 70,54 68,54 78,62 76,62 74,62 72,62 66,68 64,68 68,62 68,64 44,68 46,68 48,64 48,62 24,66 25,61 24,61 23,61 27,64 27,62 27,63 27,61 27,60 27,59 26,59 25,59 25,62 20,55 38,44 38,45 39,46 39,45 39,44 40,44 40,45 40,46 41,36 42,36 41,35 42,35 42,34 41,34 41,33 42,33 42,32 41,32 41,31 70,64 70,66 70,68 70,70 78,46 76,44 70,40 72,40 74,40 76,40 78,40 80,40 80,42 80,44 82,42 82,44 82,46 82,48 84,48 84,46 84,44 90,48 90,46 90,44 88,42 86,40 84,38 82,36 80,34 78,38 76,38 74,38 72,38 70,38 68,38 70,36 70,34 70,32 68,32 72,36 72,34 72,32 74,34 76,36 74,36 78,32 80,32 82,32 84,32 86,32 88,34 90,36 92,38 94,38 96,40 96,42 96,44 94,46 92,48 98,50 100,48 102,46 100,52 98,52 102,54 102,56 102,58 102,60 104,60 106,60 108,60 108,58 108,56 108,54 108,52 108,50 108,48 108,46 108,44 108,42 108,40 108,38 108,36 108,34 108,32 108,30 102,40 102,38 102,36 102,34 104,44 106,42 106,40 106,38 106,36 106,34 106,32 106,30 108,28 106,28 104,28 102,26 104,26 106,26 108,26 102,24 102,22 102,20 100,18 98,18 96,18 94,18 92,18 90,20 90,22 88,24 88,26 86,26 84,26 82,26 80,26 78,26 76,26 74,26 72,26 72,24 72,22 72,20 72,18 72,16 72,14 74,14 68,14 68,16 66,16 66,14 52,16 52,14 50,12 50,16 50,14 52,18 48,12 46,10 44,8 42,8 40,8 38,8 38,6 40,6 42,6 40,4 38,4 38,2 92,44 94,44 92,46 90,42 92,42 94,42 94,40 92,40 90,40 88,40 90,38 88,38 86,38 88,36 86,36 84,36 86,34 84,34 82,34 62,28 60,28 58,28 56,28 52,28 50,28 50,30 46,34 44,34 50,26 48,24 46,22 44,22 42,18 40,18 38,18 38,16 40,16 42,24 40,26 40,28 40,30 38,30 36,30 34,30 32,30 30,30 30,28 32,26 34,24 36,22 38,22 40,22 42,22 40,24 38,24 38,26 38,28 36,28 36,26 36,24 34,26 34,28 32,28 76,14 78,14 80,14 82,14 84,14 86,14 88,14 90,14 92,14 94,14 96,14 98,14 100,14 102,14 104,14 106,14 108,16 108,18 108,20 108,22 108,24 74,18 74,16 74,20 76,20 78,20 80,20 80,18 80,16 82,16 84,16 86,16 88,16 90,16 92,16 94,16 96,16 98,16 100,16 102,16 102,18 104,16 104,18 104,20 104,22 104,24 106,24 106,22 106,20 106,18 106,16 90,18 88,18 88,20 88,22 86,24 84,24 82,24 80,24 78,24 76,24 74,24 74,22 76,22 78,22 80,22 82,22 84,22 86,22 86,20 84,20 82,20 82,18 84,18 86,18 34,16 32,16 30,16 28,16 28,18 26,18 30,18 32,18 34,18 30,20 28,22 26,24 28,24 30,22 32,20 28,20 26,20 24,20 24,22 26,22 22,22 22,24 24,24 24,26 22,26 22,28 24,28 20,32 20,30 20,28 20,26 20,24 22,18 20,18 18,18 18,24 18,26 18,28 18,30 16,32 14,32 12,34 10,36 10,34 10,32 10,30 12,32 6,26 6,28 4,26 4,28 4,30 4,32 4,34 4,36 4,38 4,40 2,42 2,40 2,38 2,36 2,34 2,32 2,30 2,28 2,26 2,24 4,24 6,22 8,22 4,22 2,22 2,20 4,20 6,20 8,20 8,18 10,20 12,20 10,18 14,18 14,16 12,14 10,12 8,10 8,8 8,6 8,4 6,4 4,4 2,4 2,6 2,8 2,10 2,12 2,14 2,16 2,18 4,6 6,6 6,8 4,8 4,10 6,10 8,12 6,12 4,12 4,14 6,14 8,14 10,14 10,16 8,16 6,16 6,18 4,18 4,16 14,36 16,36 18,36 20,36 22,38 20,38 18,38 16,38 14,38 12,38 18,40 20,40 22,40 24,42 22,42 20,42 20,44 22,44 24,44 26,44 28,44 30,46 28,46 26,46 24,46 22,46 20,46 16,46 16,44 16,42 14,44 14,42 12,42 10,42 14,48 14,50 16,50 12,50 10,50 20,54 24,48 26,48 28,48 26,54 26,56 26,58 30,54 30,56 30,58 30,60 30,62 30,64 32,60 32,58 32,56 32,54 34,56 34,58 36,58 34,62 36,62 38,64 38,66 38,68 38,70 32,64 40,68 40,66 40,64 42,64 40,62 42,62 50,64 50,62 52,70 54,70 56,70 58,70 60,70 58,68 58,66 58,64 60,64 62,64 72,70 74,70 76,70 72,68 72,66 72,64 70,62 78,64 78,66 78,68 80,62 80,64 86,66 46.2,45.1 44.4,50.9
  pour Bottom: 0,74 110,74 110,0 0,0
  pour Top: -0.5,0 -0.5,74 110,74 110,0
  cutout Top: 14.83,25.6 14.83,27.64 15.85,27.64 15.85,25.6
  cutout Top: 24.99,27.43 24.99,25.4 25.81,25.4 25.81,27.43
  cutout Bottom: -2,64 -2,54 16,54 18,56 20,56 arc90 22.3,58.3 22.3,66 -2,66 -2,62
GND1
  cutout Top: -2,64 -2,54 16,54 18,56 20,56 arc90 22.3,58.3 22.3,66 -2,66 -2,62
GPS_ENABLE  (via drill 0.3)
  Top 0.2: U$2.3 30.62,36.48 R4.2 29.05,36.46 v29.05,35.05 | 22.46,31.75 22.39,31.83 v22.39,35.05
  Top 0.203: LOWER1.PIN16 23.69,3.94 23.69,3.04 25.53,1.2 35.16,1.2 36.15,2.19 36.15,18.07 22.46,31.75
  Bottom 0.2: v22.39,35.05 v29.05,35.05
GPS_RX
  Top 0.2: U$1.2 36.91,52.09 36.65,51.83 36.65,49.26 37.12,48.79 38.41,48.79 41.49,45.71 41.49,37.7 43.71,35.48 46,35.48
  Top 0.203: 46,35.48 51.3,30.18 73.03,30.18 87.28,44.43 87.28,52.52 86.45,53.35 UPPER1.PIN5
GPS_TX
  Top 0.2: U$1.1 38.22,49.55 41.89,45.88 41.89,37.9 43.87,35.91 46.17,35.91
  Top 0.203: 46.17,35.91 51.49,30.59 72.86,30.59 86.88,44.6 86.88,51.24 85.56,52.55 85.56,56.91 86.56,57.91 86.56,58.79 UPPER1.PIN16
HOTSWAP_INT  (via drill 0.35)
  Top 0.254: BACKPLANE.P3 58.98,19.48 v58.95,19.5
  Bottom 0.203: v58.95,19.5 57.65,20.78 52.37,20.78 42.88,11.28 29.67,11.28 28.85,10.46 28.85,8.58 LOWER1.PIN3
  other vias: 28.93,8.5
MOD_G0
  Top 0.152: LOWER1.PIN1 34.01,9.69
  Top 0.2: FFC1.13 20.93,21.14 30.57,11.5 32.2,11.5 34.01,9.69
MOD_G2  (via drill 0.3, 0.35)
  Top 0.152: v57.65,25.18 v57.65,19.6
  Top 0.254: BACKPLANE.P2 57.65,18.52 v57.65,19.6
  Bottom 0.2: 28.93,7.54 LOWER1.PIN18
  Bottom 0.203: v57.65,19.6 56.95,20.37 52.55,20.37 43.05,10.87 29.88,10.87 29.64,10.64 29.64,8.25 28.93,7.54 | v57.65,25.18 57.85,24.98 67.65,24.98 70.03,27.36 90.32,27.36 91.44,26.24 91.44,21.87 92.17,21.13 96.72,21.13 97.74,22.15 BACKPACK.6
  other vias: 28.93,4.1
MOD_G5  (via drill 0.35)
  Top 0.254: BACKPLANE.P5 61.45,18.54 v61.45,19.5
  Bottom 0.203: v61.45,19.5 59.34,21.59 52.01,21.59 42.52,12.09 29.32,12.09 26.39,9.16 LOWER1.PIN4
  other vias: 26.39,8.5
MOD_G13
  Top 0.2: FFC1.14 20.86,20.64 29.75,11.75 30.28,11.22 30.28,5.82
  Top 0.203: LOWER1.PIN19 31.47,4.63 30.28,5.82
MOD_G14
  Top 0.2: 35.3,5.9 35.3,10.24 33.64,11.9 30.74,11.9 21,21.64 FFC1.12
  Top 0.203: LOWER1.PIN20 34.01,4.61 35.3,5.9
MOD_MISO  (via drill 0.3, 0.35)
  Top 0.152: v67.72,27.15 67.86,27.01
  Top 0.254: BACKPLANE.P10 67.86,19.48 | 67.86,19.48 v67.85,19.5 | 67.86,27.01 67.86,19.48
  Bottom 0.203: LOWER1.PIN10 13.22,10.91 25.26,10.91 28.48,14.13 41.65,14.13 51.17,23.62 63.7,23.62 v67.85,19.5 | BACKPACK.10 92.76,29.77 91.59,28.6 69.45,28.6 68,27.15 v67.72,27.15
  other vias: 11.15,8.84
MOD_MOSI  (via drill 0.3, 0.35)
  Top 0.152: v65.38,27.77 65.33,27.72
  Top 0.254: BACKPLANE.P8 65.33,19.57 | 65.33,19.57 v65.35,19.6 | 65.33,27.72 65.33,19.57
  Bottom 0.203: v65.35,19.6 62.12,22.81 51.51,22.81 41.99,13.31 28.81,13.31 25.59,10.09 16.3,10.09 13.69,7.48 LOWER1.PIN12 | BACKPACK.11 92.79,32.31 91.85,31.37 91.85,29.44 91.44,29.03 69.3,29.03 68.04,27.77 v65.38,27.77
  other vias: 13.69,3.76
MOD_SCK  (via drill 0.3, 0.35)
  Top 0.254: BACKPLANE.P9 66.59,19.45 v66.55,19.5 v66.55,28.46
  Bottom 0.203: LOWER1.PIN9 15.35,10.5 25.43,10.5 28.64,13.72 41.82,13.72 51.34,23.22 62.81,23.22 v66.55,19.5 | v66.55,28.46 68.15,28.46 69.13,29.44 91.27,29.44 91.42,29.59 91.42,33.48 92.79,34.85 BACKPACK.12
  other vias: 13.69,8.84
MOD_SCL  (via drill 0.3, 0.35)
  Top 0.152: v62.75,25.9 62.75,25.6 62.78,25.57 | U3.4 69.59,50.01
  Top 0.2: U3.4 69.59,51.65 v73.45,55.5
  Top 0.203: U2.4 41.73,53.31 v42.27,53.85 | R9.1 93.87,24.6 v93.88,24.59
  Top 0.254: BACKPLANE.P6 62.78,19.46 | 62.78,19.46 v62.75,19.5 | 62.78,25.57 62.78,19.46
  Bottom 0.152: v73.45,55.5 73.45,56.28 73.47,56.3 | BACKPACK.8 93.78,24.69 v93.88,24.59
  Bottom 0.203: v62.75,19.5 60.23,22 51.84,22 42.33,12.5 29.15,12.5 25.93,9.28 18.29,9.28 | v62.75,25.9 63.24,25.41 67.47,25.41 69.83,27.76 90.5,27.76 91.85,26.42 91.85,25.6 92.76,24.69 BACKPACK.8 | 18.29,9.28 18.26,9.28 | 18.29,9.28 16.23,7.22 LOWER1.PIN13 | BACKPACK.8 93.57,24.69 | v42.27,53.85 42.27,54.37 42.06,54.57 42.06,55.48 42.89,56.3 73.47,56.3 75.84,53.94 91.32,53.94 104.36,40.89 104.36,29.83 100.46,25.93 95.83,25.93 94.69,24.79 93.75,24.79 BACKPACK.8
  other vias: 16.23,4.1
MOD_SDA  (via drill 0.3, 0.35)  (1 unrouted)
  Top 0.152: v64.05,26.37 v64.06,26.36 | U2.3 42.23,54.58 v42.67,55.02
  Top 0.2: U3.3 70.86,51.7 v73.98,54.82
  Top 0.203: R10.1 92.68,27.23 v93.88,27.23
  Top 0.254: BACKPLANE.P7 v64.06,19.5 | v64.06,19.5 v64.05,19.5 | v64.06,26.36 v64.06,19.5
  Bottom 0.152: v73.98,54.82 73.98,53.55 73.95,53.52
  Bottom 0.203: v64.05,19.5 61.12,22.4 51.68,22.4 42.16,12.91 28.98,12.91 25.76,9.69 17.42,9.69 LOWER1.PIN8 | v64.05,26.37 64.59,25.82 67.28,25.82 69.62,28.17 91.64,28.17 92.58,27.23 BACKPACK.9 95.1,27.23 95.98,26.34 100.3,26.34 103.96,30 103.96,40.7 91.14,53.52 73.95,53.52 71.57,55.89 43.55,55.89 v42.67,55.02
  other vias: 16.23,8.5
N$1
  Top 0.2: U$3.4 C3.1
N$2
  Top 0.2: U$2.4 33.02,36.48 C4.1
N$3
  Top 0.254: U$2.5 33,39.49 32.09,40.4 32.09,51.08 U$1.4
  Top 0.61: U$2.5 35.89,38.36 C2.+ 36.77,37.48 36.79,37.48 37.64,36.63 C5.1
N$4
  Top 0.305: U$11.ANT 25.91,62.3 25.91,60.53 25.09,59.71 U$1.11
N$5
  Top 0.203: R2.2 U6.4
N$6
  Top 0.2: U$4.4 C8.1
N$7
  Top 0.61: U$2.1 26.86,38.36 FB1.2
N$14
  Top 0.152: U6.1 48.76,43.84 48.76,43.43
  Top 0.61: 48.76,43.94 48.52,44.18 48.37,44.18 48.37,43.82 48.76,43.43 48.12,42.8 Q2.1 Q2.2 Q2.3
  Top 0.813: RX1.2 49.9,43.81 49.53,43.43 48.76,43.43
N$17
  Top 0.305: Q2.4 44.31,43.56 44.07,43.8 U6.8
N$18
  Top 0.203: C11.1 U6.5
PSWITCH
  Top 0.2: U$4.3 29.28,40.75 R1.2
  Top 0.203: U$4.3 31.31,40.75 31.55,41 31.55,48 28.14,51.41 U$5.2 30.61,67.56 31.87,68.83 J2.1
RAD_SCL
  Top 0.203: LOWER1.PIN14 18.77,5.33 19.68,6.25 19.68,12.9 | 19.68,12.9 19.68,13.97 15.13,18.52 FFC1.16 | R6.1 20.7,12.9 19.68,12.9
RAD_SDA
  Top 0.203: LOWER1.PIN7 19.27,9 19.27,12.9 | FFC1.15 14.49,20.14 14.15,19.8 14.15,18.91 19.28,13.78 19.28,12.9 19.27,12.9 | R7.1 19.27,12.9
RADIO_MISO  (via drill 0.3, 0.35, 0.4)
  Top 0.152: UPPER1.PIN14 v91.53,58.11
  Top 0.2: v20.77,49.68 20.77,49.66 19.78,48.67
  Top 0.203: U1.17 5.8,45.93 v6.16,46.29 6.16,47.92 6.92,48.67 19.78,48.67 | FFC1.9 15.1,23.12 13.87,23.12 6.15,30.84 v6.15,37.5
  Bottom 0.2: v20.77,49.68 21.89,50.8 32.16,50.8 39.72,58.36
  Bottom 0.203: 39.72,58.36 39.84,58.47 88.43,58.47 88.83,58.1 91.52,58.1 v91.53,58.11 | v6.15,37.5 v6.15,46.28
  Bottom 0.254: v6.15,46.28 v6.16,46.29
RADIO_MOSI  (via drill 0.3, 0.35, 0.4)
  Top 0.152: UPPER1.PIN15 v88.99,58.93
  Top 0.2: v11.15,22.85 11.36,22.64 FFC1.10 | 19.5,49.12 20.1,49.72 20.1,50.15 v20.05,50.2
  Top 0.203: U1.15 5.1,47.96 v6.2,49.05 6.26,49.12 19.5,49.12
  Bottom 0.2: v6.2,49.05 6.2,49.01 4.84,47.65 4.84,25.92 7.89,22.87 11.13,22.87 v11.15,22.85 | v88.99,58.93 39.7,58.93 31.98,51.2 21.05,51.2 v20.05,50.2
RADIO_SCK  (via drill 0.3, 0.35, 0.4)
  Top 0.152: UPPER1.PIN6 v88.99,55.87
  Top 0.2: 20.3,48.26 20.76,48.73 v20.76,48.79
  Top 0.203: U1.18 v7.15,44.91 7.63,44.91 8.34,44.2 12.51,44.2 16.57,48.26 20.3,48.26 | FFC1.11 9.51,22.14 v8.15,23.5
  Bottom 0.2: v20.76,48.79 22.32,50.36 32.3,50.36
  Bottom 0.203: v88.99,55.87 86.84,58.01 39.97,58.01 32.3,50.36 | v8.15,23.5 8.15,43.91 v7.15,44.91
SOL+
  Top 0.152: U3.7 72.14,45.66 72,45.8 67.8,45.8 66.8,44.8 RX3.1
  Top 0.254: C10.1 65.66,35.15 65.06,35.15 65,35.22
  Top 1.016: REG1.P$10 REG1.P$1 64.34,31.42 65,32.07 65,35.22 63.74,33.96 REG1.P$2 62.63,33.91 J1.P$2 | RX3.1 65.66,44.36 65.66,35.15
SOL+RAW
  Top 0.152: U3.8 73.41,45.59 72,47 68,47 66.1,48.9 66.1,50.37 RX3.2
  Top 1.016: SOLAR-JST.+ 63.83,61.93 65,60.76 65,50.04 65.77,50.04 66.1,50.37
SOLREG
  Top 0.152: C13.1 61.32,45.95 | 61.32,45.95
  Top 0.254: 61.32,45.95 61.4,45.87
  Top 0.61: D3.A2-1 D3.A2-2
  Top 1.016: C13.1 61.38,46.11 61.4,46.13 61.4,53.5 D3.A2-2 | 61.4,45.87 61.4,42.85 REG1.P$5 REG1.P$4 59.88,39.04 J1.P$1
UNREG  (via drill 0.3, 0.35, 0.6)
  Top 0.152: FFC1.7 13.85,24.14 v13.61,24.38
  Top 0.2: J2.2 49.95,71 52.43,68.52 52.43,61.57
  Top 0.203: v27.15,66.6 U$5.C | U$1.5 35.05,59.71 31.33,63.43 31.33,67.71 34.62,71 J2.2
  Top 0.305: FFC1.5 14.17,25.14 13.67,24.64 FFC1.6 | FFC1.8 14.15,23.64 13.41,24.38 | FFC1.7 13.66,24.14
  Top 0.406: 13.41,24.38 13.41,24.39 | 13.67,24.64 13.44,24.41 13.41,24.39 | 13.66,24.14 13.41,24.39
  Top 0.508: BACKPLANE.P14 64.06,16.59 v64.65,16 65.33,16.68 BACKPLANE.P13
  Top 0.61: U$4.1 26.94,42.65 v26.91,42.62 | U$3.1 23.53,33.91 23.4,34.04 | FB1.1 22.46,36.8 12.81,27.15 12.81,25.03 13.44,24.41
  Top 1.016: v63.1,50.75 63.1,60.09 61.62,61.57 54.86,61.57 | v26.91,42.62 23.4,39.12 FB1.1 23.4,34.04 23.4,31.96 35.41,19.95 54.52,19.95 55.38,19.1 55.38,16.32 56.55,15.15 63.8,15.15 v64.65,16 | D1.K1 51.93,61.08 52.43,61.57 54.86,61.57 | D1.K2 54.42,61.13 54.86,61.57
  Top 1.27: D1.K1 D1.K2
  Bottom 0.2: v99.35,36.6 99.35,44.08 92.08,51.34 81.2,51.34 79.84,52.71 68.37,52.71 66.82,51.16 63.51,51.16 v63.1,50.75 | v27.15,66.6 30.27,66.6 J2.2
  Bottom 0.203: BACKPACK.1 98.65,35.9 v99.35,36.6
  Bottom 1.016: v63.1,50.75 48.08,50.75 46.92,49.59 36.67,49.59 29.71,42.62 v26.91,42.62
V5  (via drill 0.3, 0.35)
  Top 0.61: v59.35,48.15 58.03,49.47 v58.03,52.28 58.03,53.73 D3.A1-1 D3.A1-2 | D1.A2-1 54.43,53.73 | 54.43,53.73 D1.A2-2 54.5,53.14 v54.5,52.33 54.43,52.39 54.43,53.73
  Bottom 0.61: v58.03,52.28 54.55,52.28 v54.5,52.33 | LOWER1.PIN11 11.15,5.66 10.31,6.5 10.31,9.51 15.94,15.14 41.19,15.14 59.35,33.3 v59.35,48.15
  other vias: 11.15,3.76
WIFI_3V3  (via drill 0.3)
  Top 0.203: 10.62,40.15 U1.23 | 9.54,38.19 9.55,38.18
  Top 0.61: 10.62,38.18 10.62,38.05 14.78,33.89 14.78,33.88 v14.81,33.88 | 10.62,38.18 10.62,40.15 | 10.62,38.18 9.55,38.18 7.51,38.18 U1.20 5.4,40.21 2.07,43.54 2.07,52.81 2.3,53.04 U1.10 | U1.22 9.54,38.19 | U$3.5 v34.19,33.91 35.89,33.91 C1.+ 37.64,32.16 C6.1
  Bottom 0.61: v34.19,33.91 34.16,33.88 v14.81,33.88
WIFI_CS  (via drill 0.3, 0.4)
  Top 0.2: 20.46,47.86 21.06,47.86 v21.25,48.05
  Top 0.203: 20.46,47.86 16.74,47.86 v12.22,43.33 | U1.16 4.99,46.94 v5.45,47.4
  Bottom 0.2: v21.25,48.05 23.16,49.96 32.49,49.96
  Bottom 0.203: UPPER1.PIN13 92.02,56.84 90.7,55.52 89.94,54.76 77.56,54.76 74.76,57.56 40.09,57.56 32.49,49.96 | v5.45,47.4 5.65,47.6 6.15,47.6 10.42,43.33 v12.22,43.33
  other vias: 94.07,58.9
WIFI_ENABLE  (via drill 0.3)
  Top 0.2: U$3.3 30.64,32.02 R3.2 29.05,31.99 v29.05,30.75 | 26.02,27.6 22.86,30.75 v22.6,30.75
  Top 0.203: 26.02,27.6 35.73,17.89 35.73,2.41 34.97,1.66 25.67,1.66 24.85,2.47 24.85,6.29 23.85,7.29 LOWER1.PIN5
  Bottom 0.2: v22.6,30.75 v29.05,30.75
WIFI_IRQ  (via drill 0.3, 0.35)
  Top 0.152: UPPER1.PIN12 v96.61,59.6
  Top 0.203: U1.13 6.46,49.99 v8.36,49.99
  Bottom 0.203: v96.61,59.6 96.59,59.59 88.03,59.59 87.78,59.38 39.57,59.38 31.79,51.61 9.98,51.61 v8.36,49.99
WIFI_RST  (via drill 0.4)
  Top 0.152: UPPER1.PIN8 94.07,53.43 v94.05,53.41
  Top 0.203: v29.96,47.32 18.8,47.32 18.31,46.83 U1.4
  Bottom 0.2: 31.04,47.32 v29.96,47.32
  Bottom 0.203: 31.04,47.32 31.86,48.14 40.46,56.74 73.61,56.74 76.01,54.34 93.11,54.34 v94.05,53.41
WIFI_WAKE  (via drill 0.3, 0.35)
  Top 0.152: 6.26,52.02
  Top 0.203: 6.26,52.02 U1.11 | UPPER1.PIN7 90.63,54.5 90.61,54.48 90.16,54.94 90.16,60.89 89.4,61.64 v88.47,61.64 | v7.37,52.02 6.26,52.02
  Bottom 0.152: v7.37,52.01 v7.37,52.02
  Bottom 0.203: v88.47,61.64 88.47,60.73 87.53,59.79 39.4,59.79 39.4,59.8 31.61,52.01 v7.37,52.01
XBTN  (via drill 0.35)
  Top 0.152: 69.6,29.12 R8.2
  Top 0.254: BACKPLANE.P4 60.24,19.41 v60.15,19.5 60.17,19.52 60.17,24.54 64.75,29.12 69.6,29.12 | R8.2 72.56,29.1 87.71,44.25 87.71,62.98 85.44,65.25 BTN-JST.-
  Bottom 0.203: v60.15,19.5 58.44,21.18 52.18,21.18 42.69,11.69 29.49,11.69 27.03,9.22 27.03,4.74 LOWER1.PIN17
  other vias: 26.39,4.1

### Text on the board
tPlace: SOLAR
tNames: BTN | OFF|ON | BATTERY